# EAGLE design Amplificador_Push_Pull_AB (EAGLE 7.6.0)
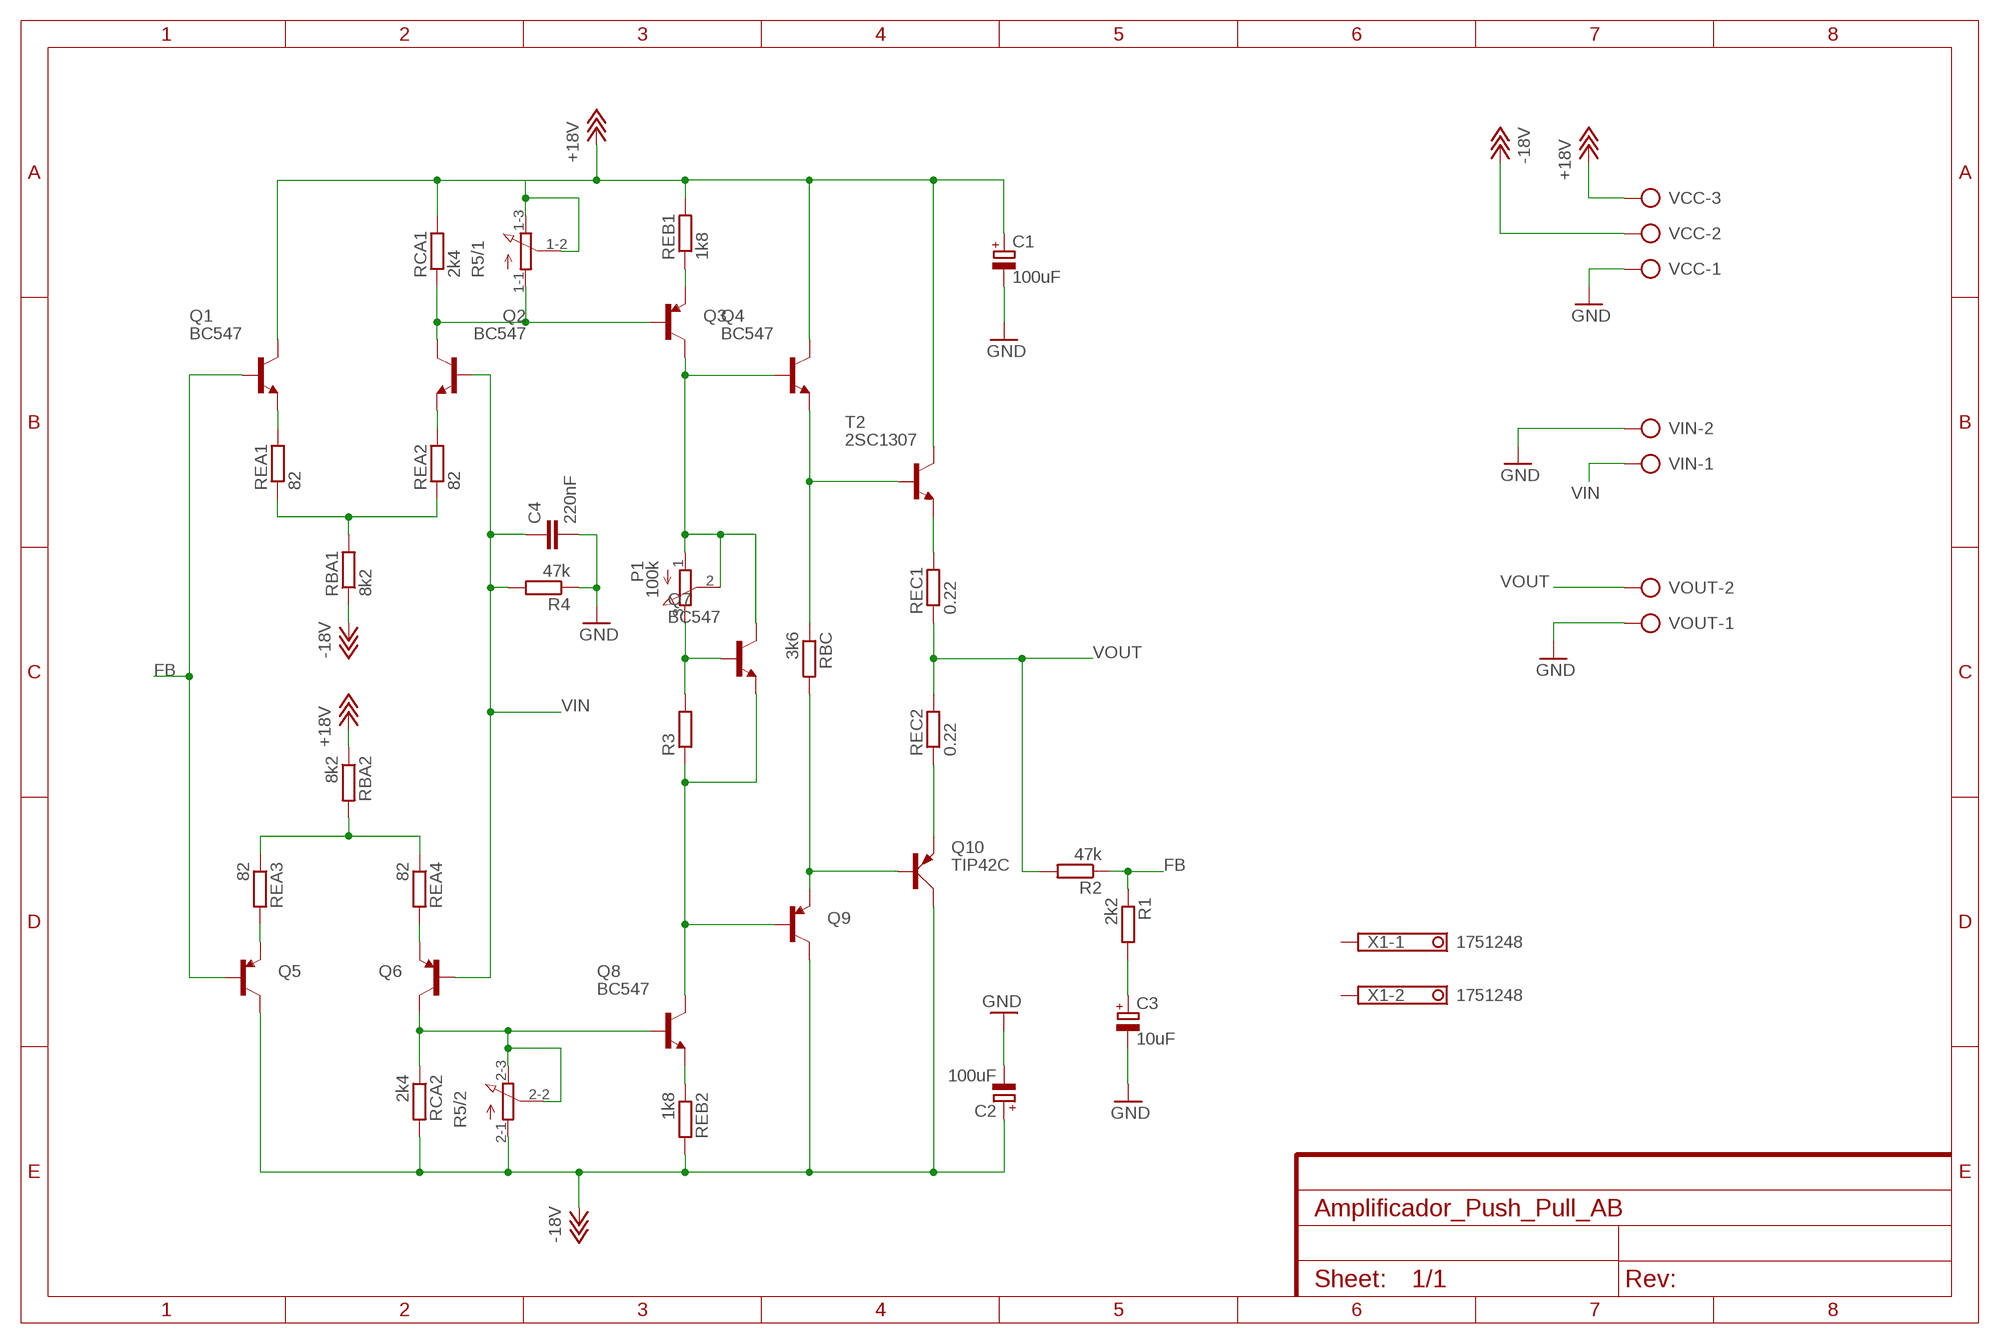
[diagram p0: schematic, sheet 1]

## Parts
C1  100uF  CPOL-EUE2.5-6  [E2,5-6]
C2  100uF  CPOL-EUE2.5-6  [E2,5-6]
C3  10uF  CPOL-EUE2.5-5  [E2,5-5]
C4  220nF  C-EU025-025X050  [C025-025X050]
P1  100k  3RP/1610N  [3RP/1610N]
Q1  BC547  [TO92]
Q2  BC547  [TO92]
Q3  TRANSISTOR_PNPTO92  [TO-92]
Q4  BC547  [TO92]
Q5  TRANSISTOR_PNPTO92  [TO-92]
Q6  TRANSISTOR_PNPTO92  [TO-92]
Q7  BC547  [TO92]
Q8  BC547  [TO92]
Q9  TRANSISTOR_PNPTO92  [TO-92]
Q10  TIP42C  [TO220AV]
R1  2k2  R-EU_0207/10  [0207/10]
R2  47k  R-EU_0207/10  [0207/10]
R3  R-EU_0207/10  [0207/10]
R4  47k  R-EU_0207/10  [0207/10]
R5  3RP/1610G  [3RP/1610G]
RBA1  8k2  R-EU_0207/10  [0207/10]
RBA2  8k2  R-EU_0207/10  [0207/10]
RBC  3k6  R-EU_0207/10  [0207/10]
RCA1  2k4  R-EU_0207/10  [0207/10]
RCA2  2k4  R-EU_0207/10  [0207/10]
REA1  82  R-EU_0207/10  [0207/10]
REA2  82  R-EU_0207/10  [0207/10]
REA3  82  R-EU_0207/10  [0207/10]
REA4  82  R-EU_0207/10  [0207/10]
REB1  1k8  R-EU_0207/10  [0207/10]
REB2  1k8  R-EU_0207/10  [0207/10]
REC1  0.22  R-EU_0617/22  [0617/22]
REC2  0.22  R-EU_0617/22  [0617/22]
T2  2SC1307  [TO220AV]
VCC  AK500/3-H  [AK500/3-H]
VIN  AK500/2-H  [AK500/2-H]
VOUT  AK500/2-H  [AK500/2-H]
X1  1751248  [1751248]

## Nets
+18V: C1.+ Q1.3(C) Q4.3(C) R5.1-2(/1:S) R5.1-3(/1:E) RBA2.1 RCA1.2 REB1.2 T2.2(C) VCC.3
-18V: C2.+ Q5.1(C) Q9.1(C) Q10.C R5.2-1(/2:A) RBA1.1 RCA2.2 REB2.2 VCC.2
FB: Q1.2(B) Q5.2(B) R1.1 R2.1
GND: C1.- C2.- C3.- C4.2 R4.1 VCC.1 VIN.2 VOUT.1
N$1: Q1.1(E) REA1.2
N$2: RBA1.2 REA1.1 REA2.1
N$3: RBA2.2 REA3.1 REA4.1
N$4: Q2.1(E) REA2.2
N$5: Q2.3(C) Q3.2(B) R5.1-1(/1:A) RCA1.1
N$6: Q6.3(E) REA4.2
N$7: Q5.3(E) REA3.2
N$8: Q6.1(C) Q8.2(B) R5.2-2(/2:S) R5.2-3(/2:E) RCA2.1
N$10: Q3.3(E) REB1.1
N$11: P1.1(A) P1.2(S) Q3.1(C) Q4.2(B) Q7.3(C)
N$13: Q4.1(E) RBC.1 T2.1(B)
N$15: Q7.1(E) Q8.3(C) Q9.2(B) R3.1
N$16: Q8.1(E) REB2.1
N$17: Q9.3(E) Q10.B RBC.2
N$19: REC1.2 T2.3(E)
N$21: Q10.E REC2.1
N$23: C3.+ R1.2
P1: P1.3(E) Q7.2(B) R3.2
VIN: C4.1 Q2.2(B) Q6.2(B) R4.2 VIN.1
VOUT: R2.2 REC1.1 REC2.2 VOUT.2
Unconnected: X1.1 X1.2

## Library data of the parts
C1-C3 = rcl:CPOL-EU: POLARIZED CAPACITOR, European symbol
C4 = rcl:C-EU: CAPACITOR, European symbol
P1 = pot:3RP/1610N: 16mm Potentiometer one level Source: http://www.alphapotentiometers.net/html/16mm_pot_2.html
Q1 Q2 Q4 Q7 Q8 = transistor:BC547: NPN TRANSISTOR
Q3 Q5 Q6 Q9 = SparkFun-DiscreteSemi:TRANSISTOR_PNP: Generic PNP BJT Double check pinouts against datasheets- not all devices are the same! MMBT3906 - 40V 200mA SOT-23 (TRANS-08052) MMBT4403 - 40V 600mA SOT-23 (TRANS-09245)
Q10 = transistor-power:TIP42C: PNP TRANSISTOR
R1-R4 RBA1 RBA2 RBC RCA1 RCA2 REA1-REA4 REB1 REB2 REC1 REC2 = rcl:R-EU_: RESISTOR, European symbol
R5 = pot:3RP/1610G: 16mm Potentiometer two level Source: http://www.alphapotentiometers.net/html/16mm_pot_2.html
T2 = transistor-neu-to92:2SC1307: NPN Transistor Silicon Epitaxial, High Frequency Power Amplifier Source: 2SC1307.pdf
VCC = con-ptr500:AK500/3-H: CONNECTOR Aug. 2004 / PTR Meßtechnik: Die Bezeichnung der Serie AK505 wurde geändert. Es handelt sich hierbei um AK500 in horizontaler Ausführung.; OC_FARNELL: unknown; OC_NEWARK: unknown
VIN VOUT = con-ptr500:AK500/2-H: CONNECTOR Aug. 2004 / PTR Meßtechnik: Die Bezeichnung der Serie AK505 wurde geändert. Es handelt sich hierbei um AK500 in horizontaler Ausführung.; OC_FARNELL: unknown; OC_NEWARK: unknown
X1 = con-phoenix-350:1751248: MKDS 1/ 2-3,5 Printklemme Nennstrom: 10 A Bemessungsspannung: 160 V Raster: 3,5 mm Polzahl: 2 Montageart: Löten Anschlussart: Schraubanschluss Anschlussrichtung vom Leiter zur Platine: 0° Source: http://eshop.phoenixcontact.com .. 1751248.pdf; OC_FARNELL: unknown; OC_NEWARK: unknown

## Board
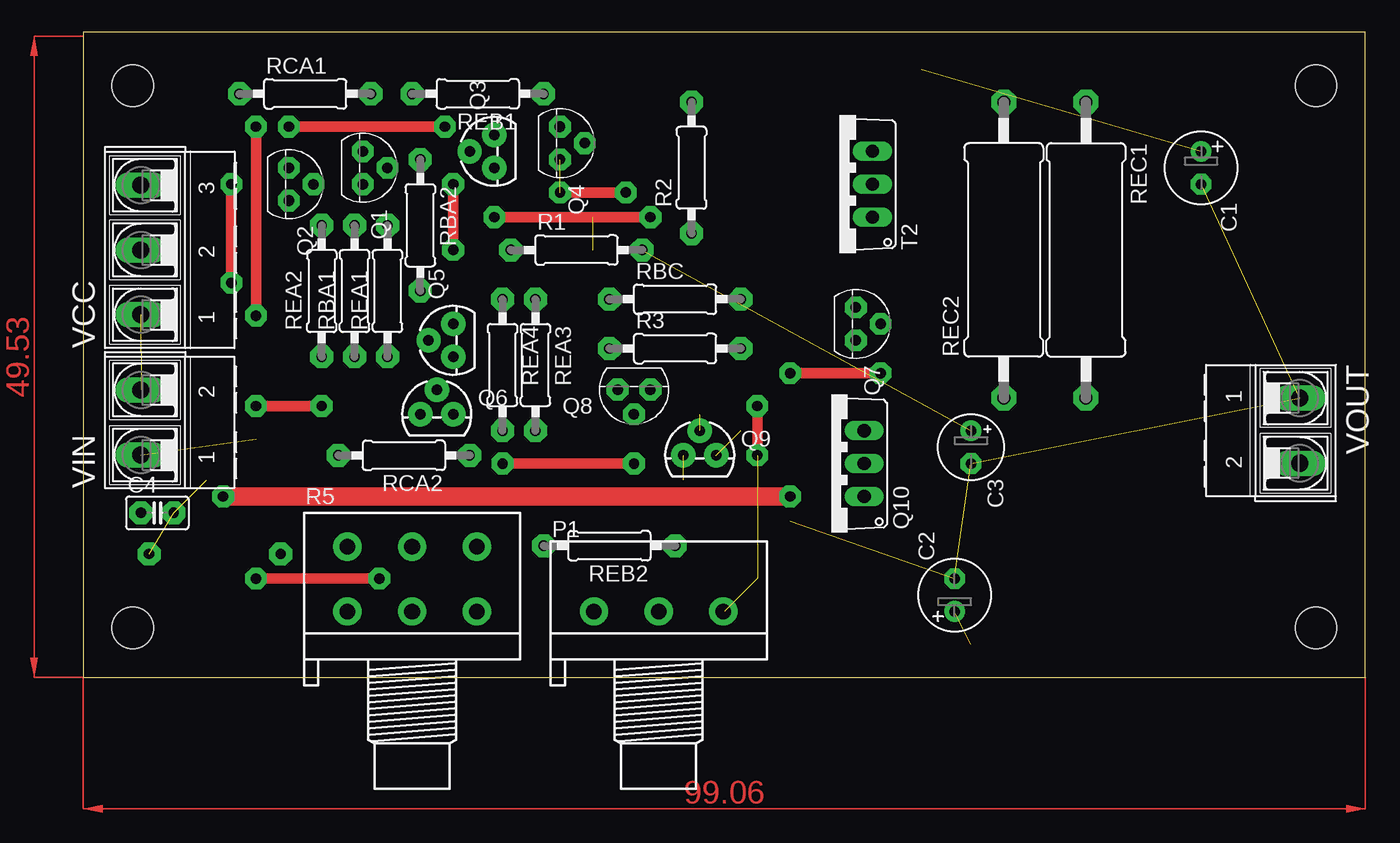
[diagram p1: board, top side]
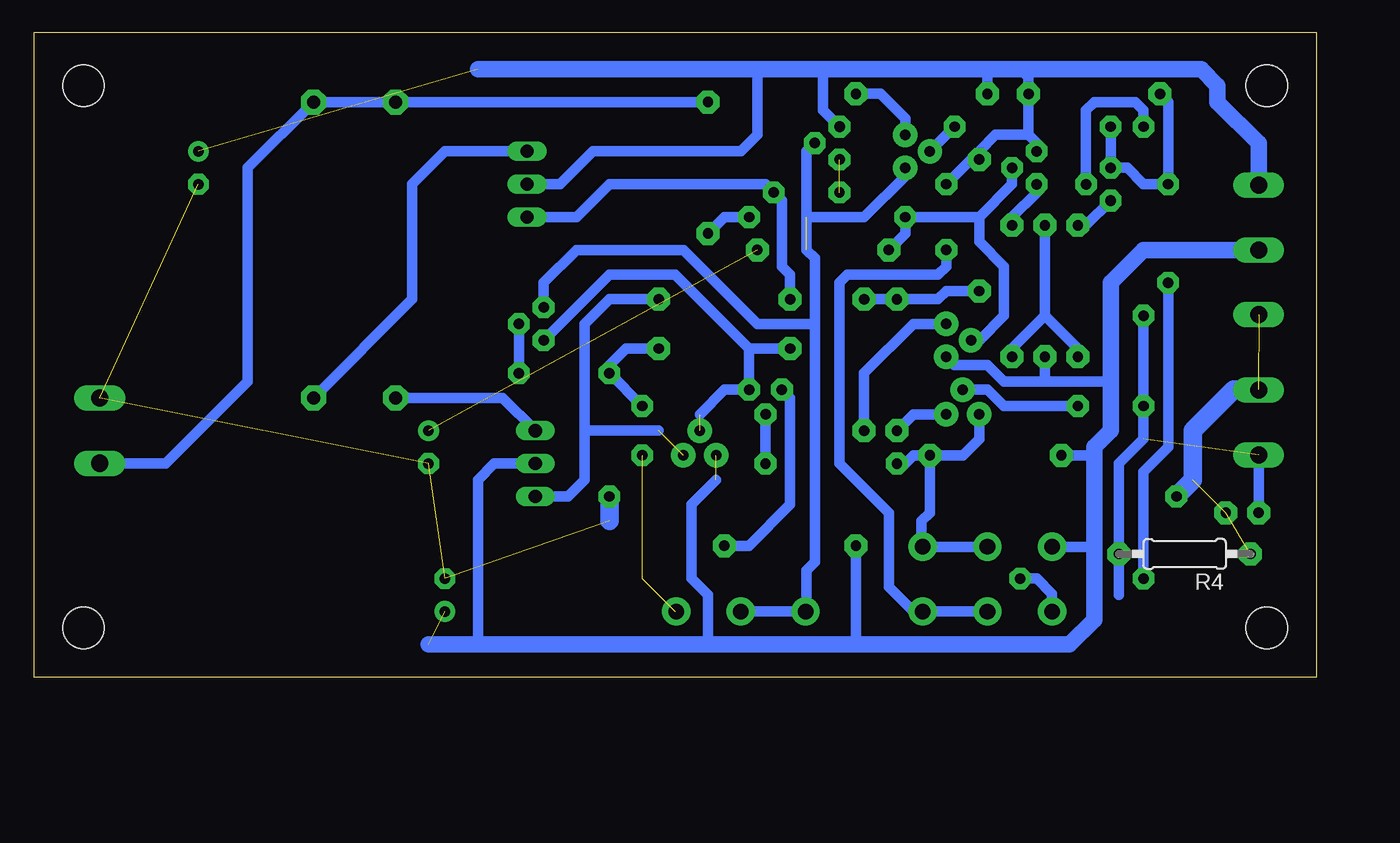
[diagram p2: board, bottom side, seen from below]

Size 99.04 x 49.84 mm. Coordinates in mm from the lower left corner, seen from the top.
Outline: 0,0 99.04,0 99.04,49.84 0,49.84 0,0
Copper layers (1*16): Top 0.035mm / dielectric 1.5mm / Bottom 0.035mm
Design rules "default": minimum track width 10mil, minimum drill 24mil, track to track 8mil, track to pad 8mil, pad to pad 8mil, via to via 8mil, smd to smd 8mil, copper to edge 40mil, drill to drill 8mil, minimum pad ring 10mil, minimum via ring 8mil, stop-mask expansion 4mil, vias tented up to drill 0mil, thermal gap 10mil
Holes 3.2 mm at 3.81,3.81 3.81,45.72 95.25,45.72 95.25,3.81

### Footprints (pad centres in the part's own frame; a part is rotated, then mirrored left to right if it is on the bottom)
E2,5-6 = drill 0.813 pad 1.6: + -1.27,0 | drill 0.813 pad 1.6 octagon: - 1.27,0
E2,5-5 = drill 0.813 pad 1.6: + -1.27,0 | drill 0.813 pad 1.6 octagon: - 1.27,0
C025-025X050 = drill 0.8 pad 1.778 octagon: 1 -1.27,0; 2 1.27,0
3RP/1610N = drill 1.2 pad 2.184: 1 -5,0; 2 0,0; 3 5,0
TO92 = drill 0.813 pad 1.676 octagon: 1 1.27,0; 2 0,1.905; 3 -1.27,0
TO-92 = drill 0.813 pad 1.88: 1 -1.27,0; 2 0,1.905; 3 1.27,0
TO220AV = drill 1.016 long: B -2.54,-2.54; C 0,-2.54; E 2.54,-2.54
0207/10 = drill 0.8 pad 1.778 octagon: 1 -5.08,0; 2 5.08,0
3RP/1610G = drill 1.2 pad 2.184: 1-1 -5,0; 1-2 0,0; 1-3 5,0; 2-1 -5,5; 2-2 0,5; 2-3 5,5
0617/22 = drill 1 pad 1.93 octagon: 1 -11.43,0; 2 11.43,0
TO220AV' = drill 1.016 long: 1 -2.54,-2.54; 2 0,-2.54; 3 2.54,-2.54
AK500/3-H = drill 1.321 long: 1 -5.004,0; 2 0,0; 3 5.004,0
AK500/2-H = drill 1.321 long: 1 -2.515,0; 2 2.515,0
1751248 = drill 1.1 pad 1.7: 1 -1.75,-0.1; 2 1.75,-0.1

### Placement (x,y rotation side)
C1  86.36,39.37 270 top
C2  67.31,6.35 90 top
C3  68.58,17.78 270 top
C4  5.71,12.7 0 top
P1  44.45,5.08 0 top
Q1  21.59,39.37 270 top
Q2  15.88,38.1 270 top
Q3  31.75,40.64 90 top
Q4  36.83,41.27 270 top
Q5  28.57,26.04 90 top
Q6  27.3,20.32 0 top
Q7  59.69,27.3 270 top
Q8  42.55,22.23 180 top
Q9  47.62,17.14 0 top
Q10  57.78,16.51 90 top
R1  38.1,33.02 0 top
R2  46.99,39.37 90 top
R3  45.72,25.4 0 top
R4  10.16,9.53 180 bottom
R5  25.4,5.08 0 top
RBA1  20.95,29.84 90 top
RBA2  26.04,34.92 270 top
RBC  45.72,29.21 0 top
RCA1  17.14,45.09 0 top
RCA2  24.77,17.14 180 top
REA1  23.5,29.84 90 top
REA2  18.41,29.84 90 top
REA3  34.92,24.13 270 top
REA4  32.38,24.13 270 top
REB1  30.48,45.09 180 top
REB2  40.64,10.16 180 top
REC1  77.47,33.02 270 top
REC2  71.12,33.02 90 top
T2  2SC1307  [TO220AV']  58.42,38.1 90 top
VCC  4.45,33.02 90 top
VIN  4.45,19.68 90 top
VOUT  93.98,19.05 270 top
X1  0,-19.05 0 top  (outside the outline)

### Tracks (layer width: path | path; a pad name or v marks a point on that pad's centre or on a via)
+18V  (via drill 0.8 pad 1.68)  (1 unrouted)
  Top 0.813: v28.57,33.02 v28.57,38.1
  Bottom 0.813: 22.23,41.91 RCA1.2 22.23,46.35 22.86,46.99 | 22.23,41.91 24.77,41.91 26.04,40.64 RBA2.1 26.67,40.01 v28.57,38.1 | R5.1-3 R5.1-2 31.11,5.08 33.02,6.99 33.02,12.7 36.83,16.51 36.83,30.48 36.2,31.11 29.21,31.11 28.57,31.75 v28.57,33.02 | T2.2 58.42,38.1 55.88,40.64 44.45,40.64 43.18,41.91 43.18,46.99 | REB1.2 25.4,46.99 | Q4.3 38.1,43.81 38.1,46.99 | 22.23,41.91 21.59,41.27 Q1.3
  Bottom 1.27: 64.77,46.99 43.18,46.99 38.1,46.99 25.4,46.99 22.86,46.99 8.89,46.99 7.62,45.72 7.62,44.45 4.45,41.27 VCC.3
-18V  (2 unrouted)
  Bottom 0.813: R5.2-1 17.23,10.08 17.14,10.16 | 46.99,2.54 46.99,6.35 48.26,7.62 48.26,13.34 46.35,15.24 | Q10.C 63.5,16.51 64.77,15.24 64.77,2.54 | 20.95,22.86 15.88,22.86 | RBA1.1 20.95,22.86 | Q5.1 27.94,24.13 25.4,24.13 24.13,22.86 20.95,22.86 | RCA2.2 17.14,17.14 | REB2.2 35.56,2.54
  Bottom 1.27: 68.58,2.54 64.77,2.54 46.99,2.54 35.56,2.54 19.05,2.54 17.14,4.45 17.14,10.16 17.14,17.14 17.14,17.78 15.88,19.05 15.88,22.86 15.88,30.48 13.34,33.02 VCC.2
FB  (via drill 0.8 pad 1.68)
  Top 0.813: v43.81,35.56 v31.75,35.56
  Bottom 0.813: R2.1 45.72,35.56 v43.81,35.56 | 26.04,35.56 v31.75,35.56 31.75,34.29 R1.1 | 26.04,35.56 23.5,38.1 Q1.2 | 26.04,35.56 26.04,33.66 24.13,31.75 24.13,27.94 26.04,26.04 Q5.2
GND  (via drill 0.8 pad 1.68)  (7 unrouted)
  Top 1.422: v10.79,13.97 v54.61,13.97
  Bottom 1.422: VIN.2 4.47,22.23 6.35,22.23 9.53,19.05 9.53,15.24 v10.79,13.97 | v54.61,13.97 54.61,12.06
N$1
  Bottom 0.813: REA1.2 23.5,35.56 21.59,37.47 Q1.1
N$2
  Bottom 0.813: REA2.1 18.41,25.4 20.95,27.94 | REA1.1 23.5,25.4 20.95,27.94 | 20.95,27.94 RBA1.2
N$3
  Bottom 0.813: REA3.1 REA4.1 29.21,29.21 28.57,29.84 RBA2.2
N$4
  Bottom 0.813: REA2.2 17.78,34.92 Q2.1
N$5  (via drill 0.8 pad 1.68)
  Top 0.813: v15.88,42.55 v27.94,42.55 | v11.43,38.1 v11.43,30.48 | v13.34,7.62 v22.86,7.62
  Bottom 0.813: v11.43,30.48 11.43,17.78 13.34,15.88 v13.34,7.62 | R5.1-1 20.4,6.43 21.59,7.62 v22.86,7.62 | RCA1.1 11.43,44.45 v11.43,38.1 13.34,38.1 14.61,39.37 Q2.3 v15.88,42.55 | v27.94,42.55 Q3.2
N$6
  Bottom 0.813: Q6.3 31.11,20.32 REA4.2
N$7
  Bottom 0.813: REA3.2 34.92,23.5 31.11,27.3 Q5.3
N$8  (via drill 0.8 pad 1.68)
  Top 0.813: v32.38,16.51 v42.55,16.51
  Bottom 0.813: R5.2-2 R5.2-3 30.48,10.16 30.48,12.06 29.84,12.7 RCA2.1 | Q6.1 26.04,18.41 27.3,17.14 RCA2.1 | RCA2.1 31.11,17.14 31.75,16.51 v32.38,16.51 | v42.55,16.51 Q8.2
N$10
  Bottom 0.813: REB1.1 33.66,45.09 31.75,43.18 Q3.3
N$11  (1 unrouted)
  Bottom 0.813: P1.1 P1.2 39.37,5.08 39.37,8.26 38.73,8.89 38.73,27.3 | Q7.3 59.69,30.48 57.15,33.02 48.9,33.02 43.18,27.3 38.73,27.3 | Q3.1 31.75,38.73 34.92,35.56 39.37,35.56 | Q4.2 39.37,40.64 39.37,33.02 38.73,32.38 38.73,27.3
N$13  (via drill 0.8 pad 1.68)  (1 unrouted)
  Top 0.813: v36.83,37.47 v41.91,37.47
  Bottom 0.813: T2.1 57.15,35.56 54.61,38.1 42.55,38.1 v41.91,37.47 41.27,36.83 41.27,31.75 40.64,31.11 RBC.1
N$15  (1 unrouted)
  Bottom 0.813: Q7.1 54.61,31.11 49.53,31.11 43.81,25.4 | 47.62,20.32 45.72,22.23 Q8.3 43.81,25.4 | 43.81,25.4 R3.1
N$16
  Bottom 0.813: REB2.1 43.81,10.16 40.64,13.34 40.64,21.59 Q8.1
N$17  (1 unrouted)
  Bottom 0.813: RBC.2 54.61,29.21 56.52,27.3 56.52,19.05 | 56.52,19.05 56.52,15.24 57.78,13.97 Q10.B | 50.8,19.05 56.52,19.05
N$19
  Bottom 0.813: REC1.2 69.85,29.21 69.85,38.1 67.31,40.64 T2.3
N$21
  Bottom 0.813: Q10.E 62.87,21.59 REC2.1
N$23  (1 unrouted)
P1  (via drill 0.8 pad 1.68)  (3 unrouted)
  Top 0.813: v52.07,17.14 v52.07,20.95 | v54.61,23.5 v61.59,23.5
  Bottom 0.813: v61.59,23.5 Q7.2 | R3.2 53.34,25.4 54.61,24.13 v54.61,23.5 v52.07,20.95 | 49.53,5.08 P1.3
VIN  (via drill 0.8 pad 1.68)  (1 unrouted)
  Top 0.813: v18.41,20.95 v13.34,20.95 | v13.34,42.55 v13.34,27.94
  Bottom 0.813: v13.34,27.94 v13.34,20.95 13.34,18.41 15.24,16.51 15.24,13.34 R4.2 15.24,6.35 | C4.1 VIN.1 | v13.34,42.55 13.34,43.81 13.97,44.45 17.14,44.45 17.78,43.81 Q2.2 | v18.41,20.95 24.13,20.95 25.4,22.23 Q6.2
VOUT
  Bottom 0.813: R2.2 REC2.2 REC1.1 82.55,39.37 82.55,22.86 88.88,16.54 VOUT.2
(copper drawn outside any net)
  shapes: Top area x2